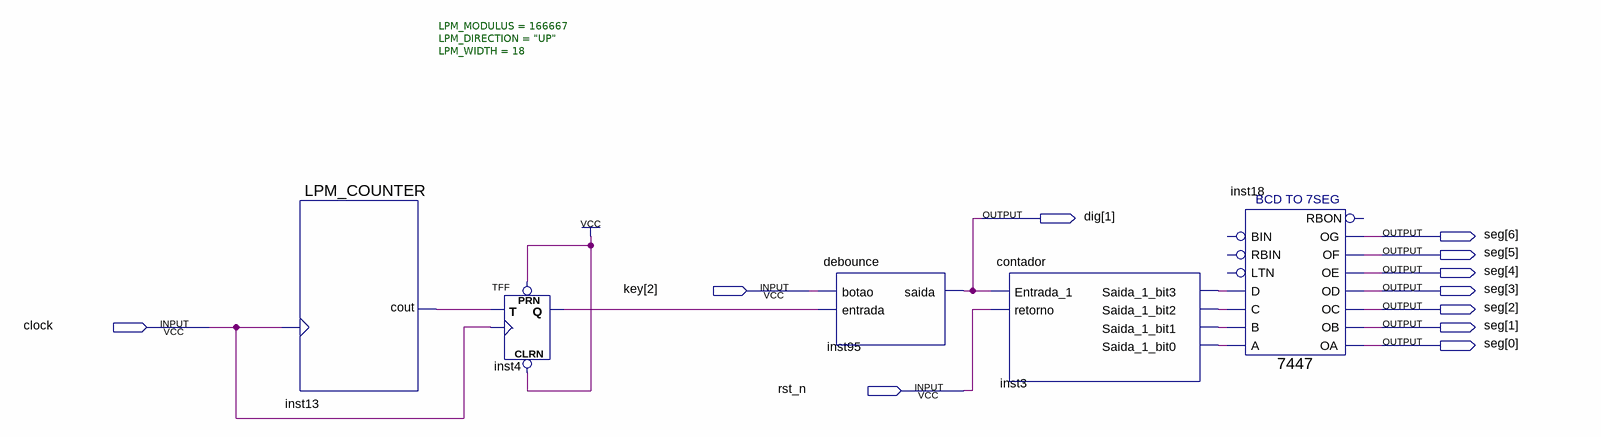
[diagram p0: schematic sheet]
// Quartus schematic teste.bdf as structural Verilog: 5 symbols, 11 pins
module teste (
  input  [2:2] key,
  input  clock,
  input  rst_n,
  output [1:1] dig,
  output [6:0] seg
);

  wire inst3_saida_1_bit0, inst3_saida_1_bit1, inst3_saida_1_bit2, inst3_saida_1_bit3, inst4_q, inst13_cout;

  LPM_COUNTER #(.LPM_MODULUS(166667), .LPM_DIRECTION("UP"), .LPM_WIDTH(18)) inst13 (.clock(clock), .cout(inst13_cout));
  TFF inst4 (.PRN(1'b1), .CLRN(1'b1), .T(inst13_cout), .CLK(clock), .Q(inst4_q));
  debounce inst95 (.botao(key[2]), .entrada(inst4_q), .saida(dig[1]));
  contador inst3 (
    .Entrada_1(dig[1]), .retorno(rst_n), .Saida_1_bit3(inst3_saida_1_bit3),
    .Saida_1_bit2(inst3_saida_1_bit2), .Saida_1_bit1(inst3_saida_1_bit1), .Saida_1_bit0(inst3_saida_1_bit0));
  \7447  inst18 (
    .B(inst3_saida_1_bit1), .C(inst3_saida_1_bit2), .D(inst3_saida_1_bit3), .A(inst3_saida_1_bit0),
    .OB(seg[1]), .OC(seg[2]), .OE(seg[4]), .OD(seg[3]), .OF(seg[5]), .OG(seg[6]), .OA(seg[0]));  // open: LTN, RBIN, BIN, RBON
endmodule
